# EAGLE schematic circuito1.1 (EAGLE 9.6.2)
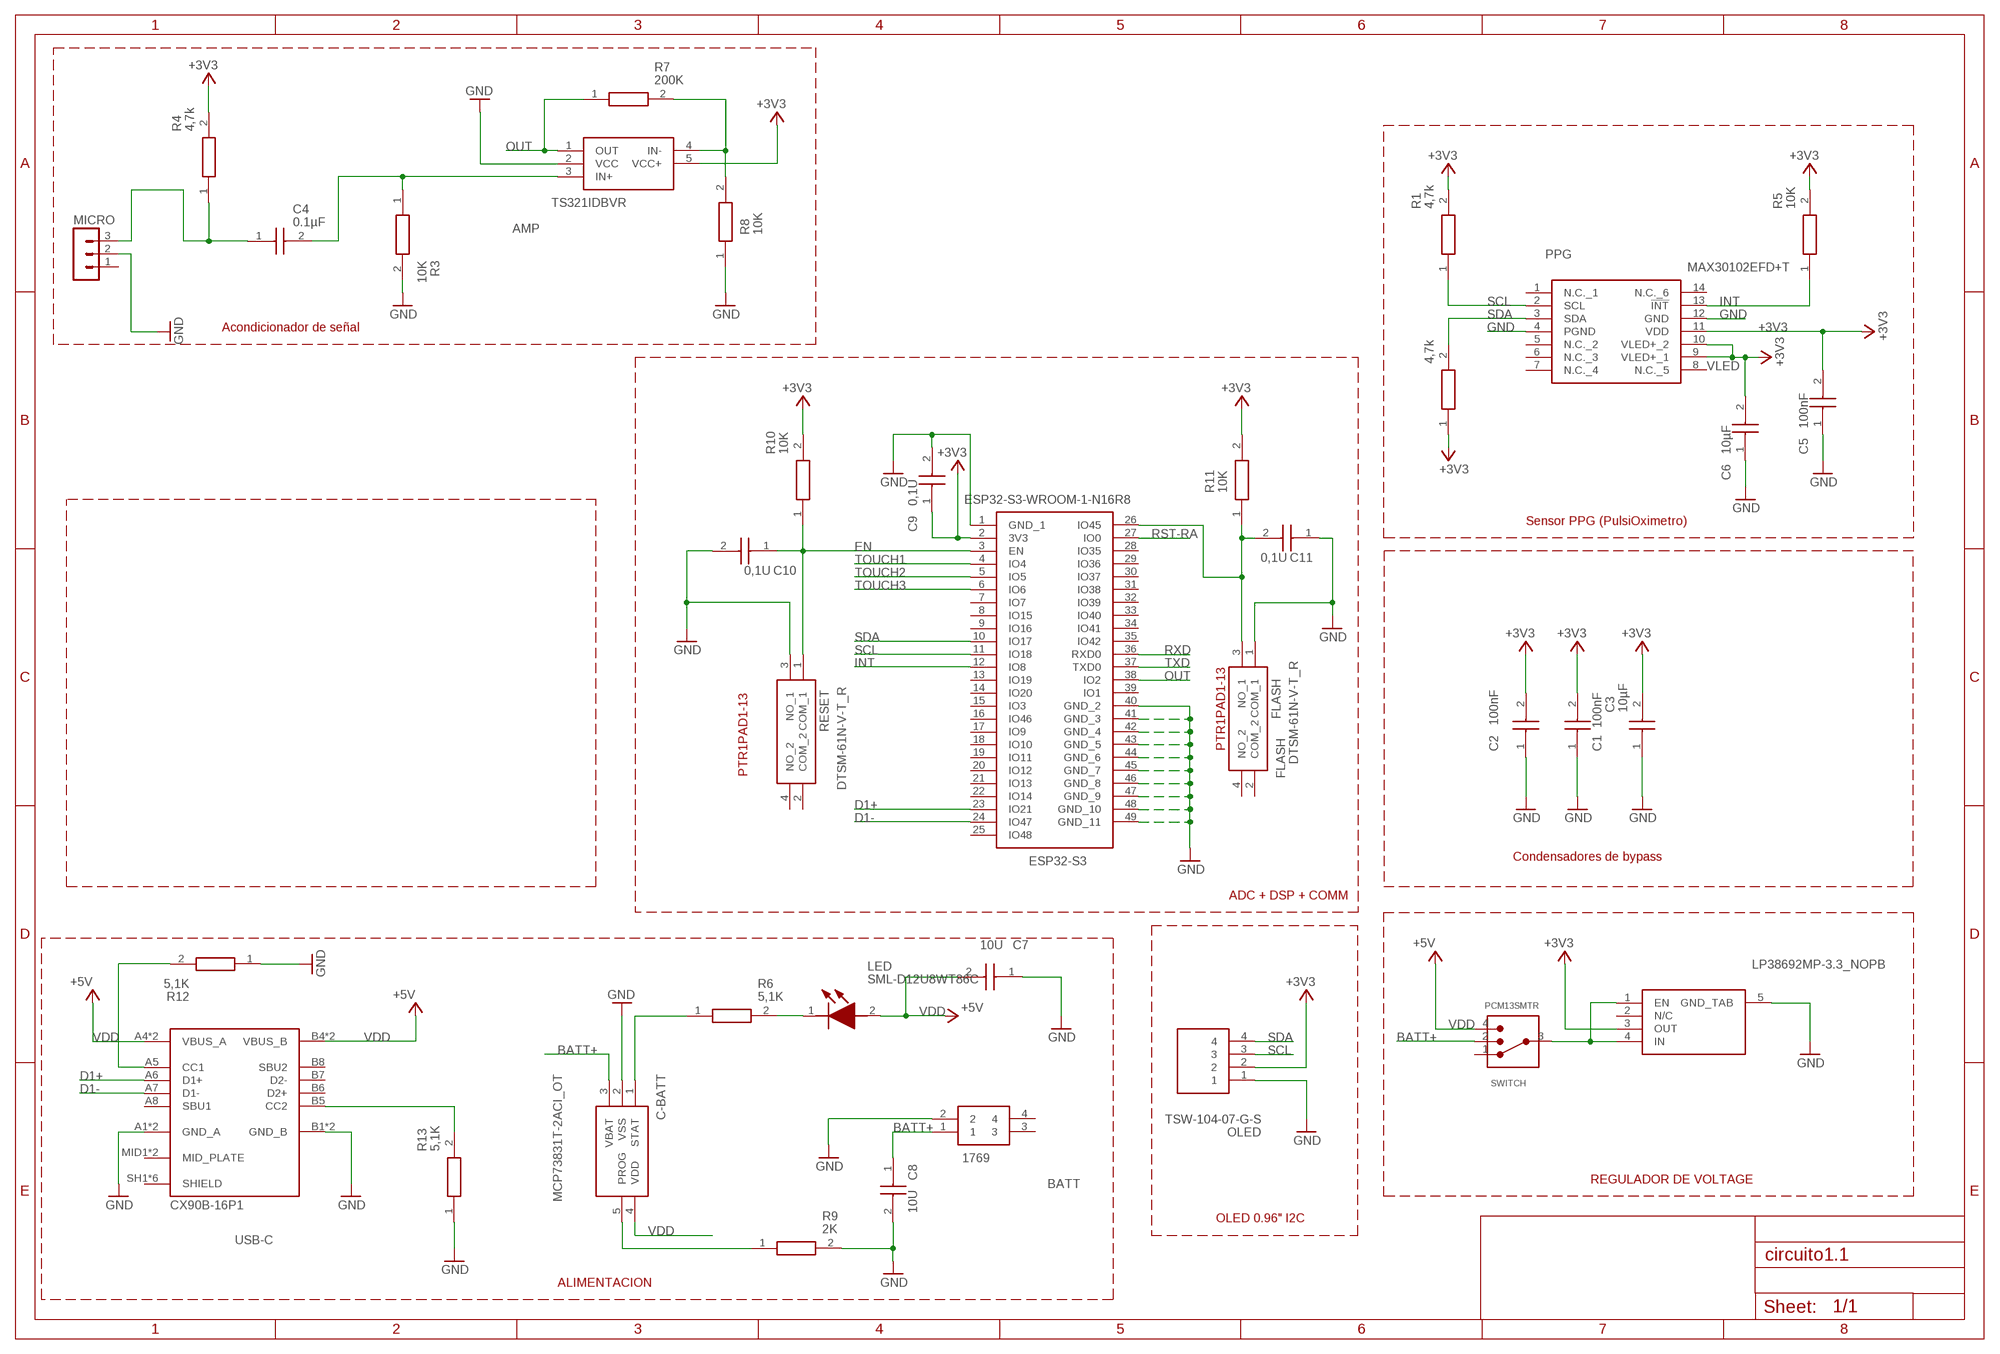
[diagram p0: schematic, sheet 1]

## Parts
AMP  TS321IDBVR  [SOT95P280X145-5N]
BATT  1769  [1769]
C1  100nF  C0805J104K1RACAUTO  [CAPC2012X140N]
C2  100nF  C0805J104K1RACAUTO  [CAPC2012X140N]
C3  10µF  C0805J104K1RACAUTO  [CAPC2012X140N]
C4  0.1µF  C0805J104K1RACAUTO  [CAPC2012X140N]
C5  100nF  C0805J104K1RACAUTO  [CAPC2012X140N]
C6  10µF  C0805J104K1RACAUTO  [CAPC2012X140N]
C7  10U  C0805J104K1RACAUTO  [CAPC2012X140N]
C8  10U  C0805J104K1RACAUTO  [CAPC2012X140N]
C9  0,1U  C0805J104K1RACAUTO  [CAPC2012X140N]
C10  0,1U  C0805J104K1RACAUTO  [CAPC2012X140N]
C11  0,1U  C0805J104K1RACAUTO  [CAPC2012X140N]
C-BATT  MCP73831T-2ACI_OT  [SOT95P270X145-5N]
ESP32-S3  ESP32-S3-WROOM-1-N16R8  [ESP32S3WROOM1N16R8]
FLASH  DTSM-61N-V-T_R  [DTSM61NVTR]
LED  SML-D12U8WT86C  [LEDC1608X65N]
MICRO  MA03-1  [MA03-1]
OLED  TSW-104-07-G-S  [TSW10407GS]
PPG  MAX30102EFD+T  [MAX30102EFDT]
R1  4,7k  0805S8F1202P5E  [RESC2013X65N]
R2  4,7k  0805S8F1202P5E  [RESC2013X65N]
R3  10K  0805S8F1202P5E  [RESC2013X65N]
R4  4,7k  0805S8F1202P5E  [RESC2013X65N]
R5  10K  0805S8F1202P5E  [RESC2013X65N]
R6  5,1K  0805S8F1202P5E  [RESC2013X65N]
R7  200K  0805S8F1202P5E  [RESC2013X65N]
R8  10K  0805S8F1202P5E  [RESC2013X65N]
R9  2K  0805S8F1202P5E  [RESC2013X65N]
R10  10K  0805S8F1202P5E  [RESC2013X65N]
R11  10K  0805S8F1202P5E  [RESC2013X65N]
R12  5,1K  0805S8F1202P5E  [RESC2013X65N]
R13  5,1K  0805S8F1202P5E  [RESC2013X65N]
REGV  LP38692MP-3.3_NOPB  [SOT150P700X180-5N]
RESET  DTSM-61N-V-T_R  [DTSM61NVTR]
SWITCH  PCM13SMTR  [SW_PCM13SMTR]
USB-C  CX90B-16P1  [HIROSE_CX90B-16P1]

## Nets
+3V3: AMP.5(VCC+) C1.2 C2.2 C3.2 C5.2 C9.1 ESP32-S3.2(3V3) OLED.2 PPG.11(VDD) R1.2 R2.1 R4.2 R5.2 R10.2 R11.2 REGV.3(OUT)
BATT+: BATT.1 C8.1 C-BATT.3(VBAT) SWITCH.2
D1+: ESP32-S3.23(IO21) USB-C.A6(D1+)
D1-: ESP32-S3.24(IO47) USB-C.A7(D1-)
EN: C10.1 ESP32-S3.3(EN) R10.1 RESET.1(COM_1)
GND: AMP.2(VCC) BATT.2 C1.1 C2.1 C3.1 C5.1 C6.1 C7.1 C8.2 C9.2 C10.2 C11.1 C-BATT.2(VSS) ESP32-S3.1(GND_1) ESP32-S3.40(GND_2) ESP32-S3.41(GND_3) ESP32-S3.42(GND_4) ESP32-S3.43(GND_5) ESP32-S3.44(GND_6) ESP32-S3.45(GND_7) ESP32-S3.46(GND_8) ESP32-S3.47(GND_9) ESP32-S3.48(GND_10) ESP32-S3.49(GND_11) FLASH.1(COM_1) MICRO.2 OLED.1 PPG.4(PGND) PPG.12(GND) R3.2 R8.1 R9.2 R12.1 R13.1 REGV.5(GND_TAB) RESET.3(NO_1) USB-C.A1(GND_A) USB-C.A12(GND_A) USB-C.B1(GND_B) USB-C.B12(GND_B)
INT: ESP32-S3.12(IO8) PPG.13(!INT) R5.1
N$1: AMP.3(IN+) C4.2 R3.1
N$3: C-BATT.1(STAT) R6.1
N$4: AMP.4(IN-) R7.2 R8.2
N$5: LED.1(K) R6.2
N$6: REGV.1(EN) REGV.4(IN) SWITCH.3
N$8: R12.2 USB-C.A5(CC1)
N$9: R13.2 USB-C.B5(CC2)
N$11: C4.1 MICRO.3 R4.1
N$13: C-BATT.5(PROG) R9.1
N$5023: C11.2 ESP32-S3.26(IO45) FLASH.3(NO_1) R11.1
OUT: AMP.1(OUT) ESP32-S3.38(IO2) R7.1
RST-RA: ESP32-S3.27(IO0)
RXD: ESP32-S3.36(RXD0)
SCL: ESP32-S3.11(IO18) OLED.3 PPG.2(SCL) R1.1
SDA: ESP32-S3.10(IO17) OLED.4 PPG.3(SDA) R2.2
TOUCH1: ESP32-S3.4(IO4)
TOUCH2: ESP32-S3.5(IO5)
TOUCH3: ESP32-S3.6(IO6)
TXD: ESP32-S3.37(TXD0)
VDD: C7.2 C-BATT.4(VDD) LED.2(A) SWITCH.4 USB-C.A4(VBUS_A) USB-C.A9(VBUS_A) USB-C.B4(VBUS_B) USB-C.B9(VBUS_B) ; supply symbol labelled +5V
VLED: C6.2 PPG.9(VLED+_1) PPG.10(VLED+_2) ; supply symbol labelled +3V3
Unconnected: BATT.3 BATT.4 ESP32-S3.7(IO7) ESP32-S3.8(IO15) ESP32-S3.9(IO16) ESP32-S3.13(IO19) ESP32-S3.14(IO20) ESP32-S3.15(IO3) ESP32-S3.16(IO46) ESP32-S3.17(IO9) ESP32-S3.18(IO10) ESP32-S3.19(IO11) ESP32-S3.20(IO12) ESP32-S3.21(IO13) ESP32-S3.22(IO14) ESP32-S3.25(IO48) ESP32-S3.28(IO35) ESP32-S3.29(IO36) ESP32-S3.30(IO37) ESP32-S3.31(IO38) ESP32-S3.32(IO39) ESP32-S3.33(IO40) ESP32-S3.34(IO41) ESP32-S3.35(IO42) ESP32-S3.39(IO1) FLASH.2(COM_2) FLASH.4(NO_2) MICRO.1 PPG.1(N.C._1) PPG.5(N.C._2) PPG.6(N.C._3) PPG.7(N.C._4) PPG.8(N.C._5) PPG.14(N.C._6) REGV.2(N/C) RESET.2(COM_2) RESET.4(NO_2) SWITCH.1 USB-C.A8(SBU1) USB-C.B6(D2+) USB-C.B7(D2-) USB-C.B8(SBU2) USB-C.MID1(MID_PLATE) USB-C.MID2(MID_PLATE) USB-C.SH1(SHIELD) USB-C.SH2(SHIELD) USB-C.SH3(SHIELD) USB-C.SH4(SHIELD) USB-C.SH5(SHIELD) USB-C.SH6(SHIELD)

## Notes on the sheet
- Acondicionador de señal
- Sensor PPG (PulsiOximetro)
- PTR1PAD1-13
- PTR1PAD1-13
- FLASH
- RESET
- Condensadores de bypass
- ADC + DSP + COMM
- REGULADOR DE VOLTAGE
- OLED 0.96" I2C
- ALIMENTACION

## Library data of the parts
AMP = TS321IDBVR:TS321IDBVR: Texas Instruments TS321IDBVR Op Amp, 0.8MHz, 5 32 V, 5-Pin SOT-23 Source: Datasheet <http://www.ti.com/lit/gpn/ts321>; DESCRIPTION: Texas Instruments TS321IDBVR Op Amp, 0.8MHz, 5 32 V, 5-Pin SOT-23; HEIGHT: 1.45mm; MANUFACTURER_NAME: Texas Instruments; MANUFACTURER_PART_NUMBER: TS321IDBVR; MOUSER_PART_NUMBER: 595-TS321IDBVR; MOUSER_PRICE-STOCK: https://www.mouser.co.uk/ProductDetail/Texas-Instruments/TS321IDBVR?qs=BBezV1N05%2FuyNsgiemJ6Dw%3D%3D
BATT = 1769:1769: Adafruit Accessories JST-PH 2-pin SMT Right Angle Connect Source: Datasheet <https://cdn-shop.adafruit.com/datasheets/17311.pdf>; DESCRIPTION: Adafruit Accessories JST-PH 2-pin SMT Right Angle Connect; HEIGHT: 5.5mm; MANUFACTURER_NAME: Adafruit; MANUFACTURER_PART_NUMBER: 1769; MOUSER_PART_NUMBER: 485-1769; MOUSER_PRICE-STOCK: https://www.mouser.co.uk/ProductDetail/Adafruit/1769?qs=GURawfaeGuBbgoGtf2XstA%3D%3D
C1-C11 = C0805J104K1RACAUTO:C0805J104K1RACAUTO: SMD Auto X7R FO, Ceramic, 0.1 uF, 10%, 100 VDC, X7R, SMD, MLCC, Open Mode, Automotive Grade, 0805, 0.6 mm Source: Datasheet <https://search.kemet.com/component-documentation/download/specsheet/C0805J104K1RACAUTO>; DESCRIPTION: SMD Auto X7R FO, Ceramic, 0.1 uF, 10%, 100 VDC, X7R, SMD, MLCC, Open Mode, Automotive Grade, 0805, 0.6 mm; HEIGHT: 1.4mm; MANUFACTURER_NAME: KEMET; MANUFACTURER_PART_NUMBER: C0805J104K1RACAUTO
C-BATT = MCP73831T-2ACI_OT:MCP73831T-2ACI_OT: Li-Ion Charge Controller 4.2V SOT23-5 Source: Datasheet <http://ww1.microchip.com/downloads/en/DeviceDoc/20001984g.pdf>; DESCRIPTION: Li-Ion Charge Controller 4.2V SOT23-5; HEIGHT: 1.45mm; MANUFACTURER_NAME: Microchip; MANUFACTURER_PART_NUMBER: MCP73831T-2ACI/OT; MOUSER_PART_NUMBER: 579-MCP73831T-2ACIOT; MOUSER_PRICE-STOCK: https://www.mouser.co.uk/ProductDetail/Microchip-Technology/MCP73831T-2ACI-OT?qs=yUQqVecv4qvbBQBGbHx0Mw%3D%3D
ESP32-S3 = ESP32-S3-WROOM-1-N16R8:ESP32-S3-WROOM-1-N16R8: Multiprotocol Modules SMD Module, ESP32-S3R8, 3.3V, 8 MB Octal PSRAM Die, 16 MB Quad SPI Flash, PCB Antenna Source: Datasheet <https://www.espressif.com/sites/default/files/documentation/esp32-s3-wroom-1_wroom-1u_datasheet_en.pdf>; DESCRIPTION: Multiprotocol Modules SMD Module, ESP32-S3R8, 3.3V, 8 MB Octal PSRAM Die, 16 MB Quad SPI Flash, PCB Antenna; HEIGHT: 3.25mm; MANUFACTURER_NAME: Espressif Systems; MANUFACTURER_PART_NUMBER: ESP32-S3-WROOM-1-N16R8; MOUSER_PART_NUMBER: 356-ESP32S3WRM1N16R8; MOUSER_PRICE-STOCK: https://www.mouser.co.uk/ProductDetail/Espressif-Systems/ESP32-S3-WROOM-1-N16R8?qs=Li%252BoUPsLEnvQc9gW6AMhZg%3D%3D
FLASH RESET = DTSM-61N-V-T_R:DTSM-61N-V-T_R: Tactile Switches Surface Mounting Type 6*6 Source: Datasheet <http://www.dip.com.tw/en/en-product-information/en-switch004/item/download/2502_92b64433b455dc19d9198989b26071be>; DESCRIPTION: Tactile Switches Surface Mounting Type 6*6; HEIGHT: 4.4mm; MANUFACTURER_NAME: Diptronics; MANUFACTURER_PART_NUMBER: DTSM-61N-V-T/R; MOUSER_PART_NUMBER: 113-DTSM-61N-V-T/R; MOUSER_PRICE-STOCK: https://www.mouser.co.uk/ProductDetail/Diptronics/DTSM-61N-V-T-R?qs=gTYE2QTfZfSEmzuLs2FKeQ%3D%3D
LED = SML-D12U8WT86C:SML-D12U8WT86C: ROHM SML-D12U8WT86C, EXCELED 625 nm Red LED, 0603 Milky White SMD package Source: Datasheet <https://datasheet.datasheetarchive.com/originals/distributors/DKDS-39/8732.pdf>; DESCRIPTION: ROHM SML-D12U8WT86C, EXCELED 625 nm Red LED, 0603 Milky White SMD package; HEIGHT: 0.65mm; MANUFACTURER_NAME: ROHM Semiconductor; MANUFACTURER_PART_NUMBER: SML-D12U8WT86C; MOUSER_PART_NUMBER: 755-SML-D12U8WT86C; MOUSER_PRICE-STOCK: https://www.mouser.co.uk/ProductDetail/ROHM-Semiconductor/SML-D12U8WT86C?qs=HXFqYaX1Q2wNcb%2FPJz96zg%3D%3D
MICRO = con-lstb:MA03-1: PIN HEADER; OC_FARNELL: unknown; OC_NEWARK: unknown
OLED = TSW-104-07-G-S:TSW-104-07-G-S: Samtec, TSW, 4 Way, 1 Row, Straight Pin Header Source: Datasheet <http://suddendocs.samtec.com/prints/tsw-xxx-xx-xxx-x-xx-xxx-mkt.pdf>; DESCRIPTION: Samtec, TSW, 4 Way, 1 Row, Straight Pin Header; HEIGHT: mm; MANUFACTURER_NAME: SAMTEC; MANUFACTURER_PART_NUMBER: TSW-104-07-G-S; MOUSER_PART_NUMBER: 200-TSW10407GS; MOUSER_PRICE-STOCK: https://www.mouser.co.uk/ProductDetail/Samtec/TSW-104-07-G-S?qs=hzq9O0YpnZuXshDH2O29kQ%3D%3D
PPG = MAX30102EFD+T:MAX30102EFD+T: Biometric Sensors Integrated Optical Sensor Source: Datasheet <https://www.analog.com/media/en/technical-documentation/data-sheets/MAX30102.pdf>; DESCRIPTION: Biometric Sensors Integrated Optical Sensor; HEIGHT: 1.65mm; MANUFACTURER_NAME: Analog Devices; MANUFACTURER_PART_NUMBER: MAX30102EFD+T; MOUSER_PART_NUMBER: 700-MAX30102EFD+T; MOUSER_PRICE-STOCK: https://www.mouser.co.uk/ProductDetail/Analog-Devices-Maxim-Integrated/MAX30102EFD%2bT?qs=nVS1qgv%252BQrkHA4%2FoFYriFA%3D%3D
R1-R13 = 0805S8F1202P5E:0805S8F1202P5E: Jumper Wires & Zero-ohm Resistors Source: Datasheet <https://co.mouser.com/datasheet/3/5925/1/1.pdf>; DESCRIPTION: Jumper Wires & Zero-ohm Resistors; HEIGHT: 0.65mm; MANUFACTURER_NAME: ROYALOHM; MANUFACTURER_PART_NUMBER: 0805S8F1202P5E
REGV = LP38692MP-3.3_NOPB:LP38692MP-3.3_NOPB: LP38692MP-3.3/NOPB, Low Dropout Voltage Regulator, 1A, 3.3 V +/-2.5%, 2.7 10 Vin, 5-Pin SOT-223 Source: Datasheet <http://www.ti.com/lit/ds/symlink/lp38692.pdf>; DESCRIPTION: LP38692MP-3.3/NOPB, Low Dropout Voltage Regulator, 1A, 3.3 V +/-2.5%, 2.7 10 Vin, 5-Pin SOT-223; HEIGHT: 1.8mm; MANUFACTURER_NAME: Texas Instruments; MANUFACTURER_PART_NUMBER: LP38692MP-3.3/NOPB; MOUSER_PART_NUMBER: 926-LP38692MP3.3NOPB; MOUSER_PRICE-STOCK: https://www.mouser.co.uk/ProductDetail/Texas-Instruments/LP38692MP-3.3-NOPB?qs=1FNqv8aZn1TpKuOP2NKBdg%3D%3D
SWITCH = PCM13SMTR:PCM13SMTR: Check availability <https://pricing.snapeda.com/parts/PCM13SMTR/C%26K/view-part?ref=eda>; AVAILABILITY: In Stock; CHECK_PRICES: https://www.snapeda.com/parts/PCM13SMTR/C%2526K/view-part/?ref=eda; DESCRIPTION: Slide Switch SP3T Surface Mount, Right Angle; MF: C&K; MP: PCM13SMTR; PACKAGE: None; PRICE: None; SNAPEDA_LINK: https://www.snapeda.com/parts/PCM13SMTR/C%2526K/view-part/?ref=snap
USB-C = CX90B-16P1:CX90B-16P1: Check availability <https://pricing.snapeda.com/parts/CX90B-16P1/Hirose%20Electric%20Co%20Ltd/view-part?ref=eda>; AVAILABILITY: In Stock; CHECK_PRICES: https://www.snapeda.com/parts/CX90B-16P1/Hirose+Electric+Co+Ltd/view-part/?ref=eda; DESCRIPTION: Serie CX, receptáculo de conector rectangular; MF: Hirose Electric Co Ltd; MP: CX90B-16P1; PACKAGE: None; PRICE: None; SNAPEDA_LINK: https://www.snapeda.com/parts/CX90B-16P1/Hirose+Electric+Co+Ltd/view-part/?ref=snap